# EAGLE schematic r3eflow-v2-outdated (EAGLE 9.3.0)
CREVISION: 1.0; DESIGNER: Rafael Silva

## Sheet 1 of 4: Main Controller
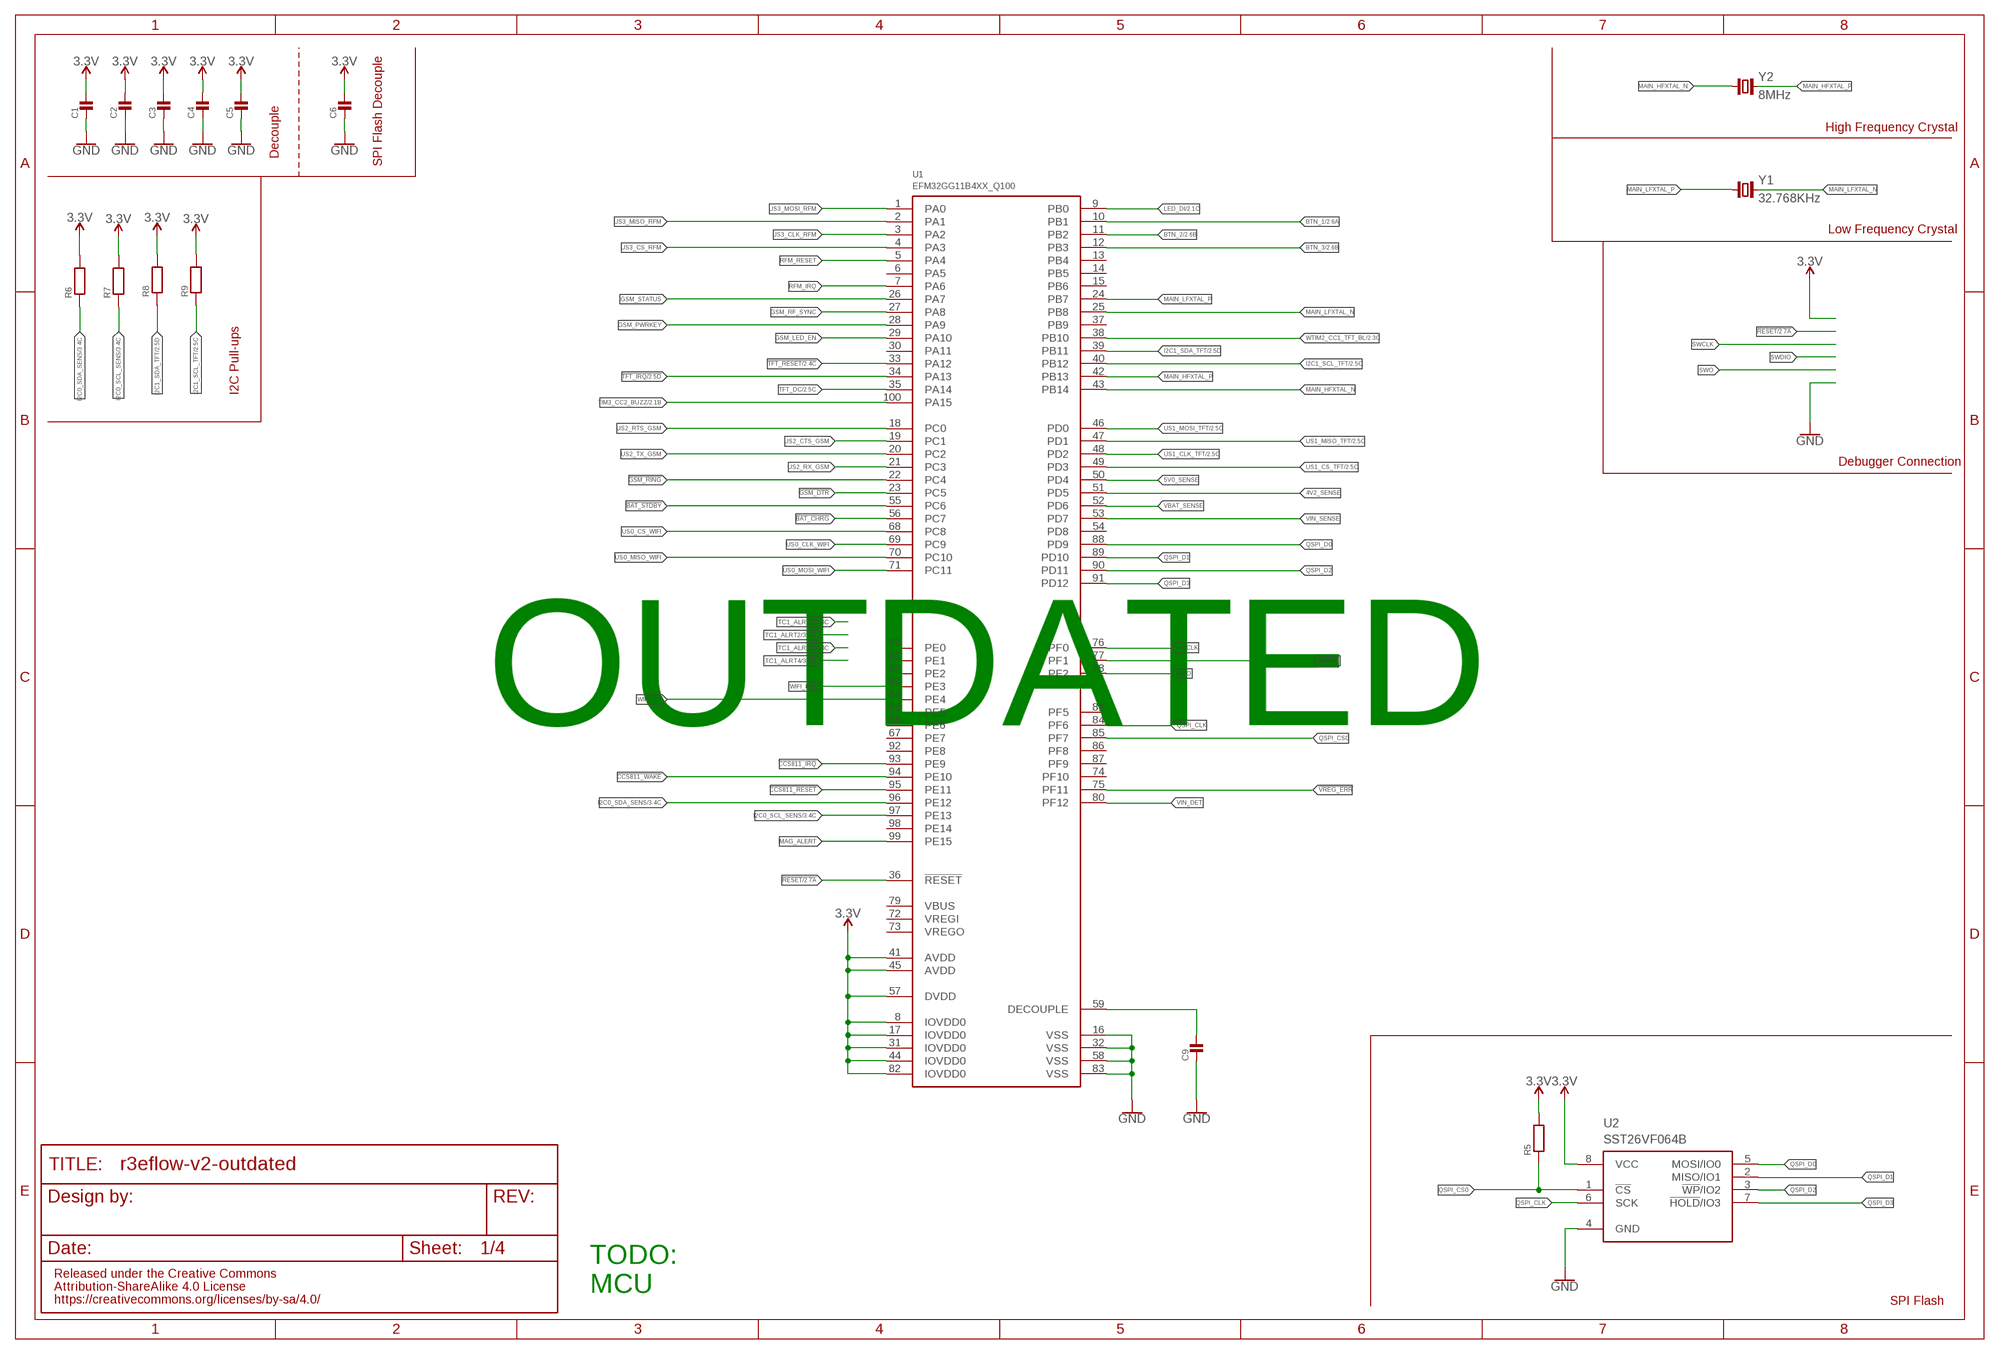
[diagram p0: schematic, sheet 1]

### Parts
C1  MLCC0603  [0603_WAVE]
C2  MLCC0603  [0603_WAVE]
C3  MLCC0603  [0603_WAVE]
C4  MLCC0603  [0603_WAVE]
C5  MLCC0603  [0603_WAVE]
C6  MLCC0603  [0603_WAVE]
C9  MLCC0603  [0603_WAVE]
R5  RESISTOR0603  [0603_WAVE]
R6  RESISTOR0603  [0603_WAVE]
R7  RESISTOR0603  [0603_WAVE]
R8  RESISTOR0603  [0603_WAVE]
R9  RESISTOR0603  [0603_WAVE]
U1  EFM32GG11B4XX_Q100  [QFP100]
U2  SST26VF064B  [WSOIC8]
Y1  32.768KHz  CRYSTALCM200S  [CM200S]
Y2  8MHz  CRYSTALNX5032GA  [2-SMD-5X3]

### Nets
3.3V: C1.P$1 C2.P$1 C3.P$1 C4.P$1 C5.P$1 C6.P$1 R5.P$2 R6.P$2 R7.P$2 R8.P$2 R9.P$2 U1.8(IOVDD0) U1.17(IOVDD0) U1.31(IOVDD0) U1.41(AVDD) U1.44(IOVDD0) U1.45(AVDD) U1.57(DVDD) U1.82(IOVDD0) U2.8(VCC) ; also sheet 2,3,4
4V2_SENSE: U1.51(PD5)
5V0_SENSE: U1.50(PD4)
!BAT_CHRG: U1.56(PC7)
!BAT_STDBY: U1.55(PC6)
!CCS811_IRQ: U1.93(PE9)
!CCS811_RESET: U1.95(PE11)
!CCS811_WAKE: U1.94(PE10)
!GSM_DTR: U1.23(PC5)
!GSM_RING: U1.22(PC4)
!RESET: U1.36(!RESET) ; also sheet 2
!TFT_IRQ: U1.34(PA13) ; also sheet 2
!TFT_RESET: U1.33(PA12) ; also sheet 2
!VREG_ERR: U1.75(PF11)
BTN_1: U1.10(PB1) ; also sheet 2
BTN_2: U1.11(PB2) ; also sheet 2
BTN_3: U1.12(PB3) ; also sheet 2
GND: C1.P$2 C2.P$2 C3.P$2 C4.P$2 C5.P$2 C6.P$2 C9.P$2 U1.16(VSS) U1.32(VSS) U1.58(VSS) U1.83(VSS) U2.4(GND) ; also sheet 2,3,4
GSM_LED_EN: U1.29(PA10)
GSM_PWRKEY: U1.28(PA9)
GSM_RF_SYNC: U1.27(PA8)
GSM_STATUS: U1.26(PA7)
I2C0_SCL_SENS: R7.P$1 U1.97(PE13) ; also sheet 3
I2C0_SDA_SENS: R6.P$1 U1.96(PE12) ; also sheet 3
I2C1_SCL_TFT: R9.P$1 U1.40(PB12) ; also sheet 2
I2C1_SDA_TFT: R8.P$1 U1.39(PB11) ; also sheet 2
LED_DI: U1.9(PB0) ; also sheet 2
MAG_ALERT: U1.99(PE15)
MAIN_HFXTAL_N: U1.43(PB14) Y2.1
MAIN_HFXTAL_P: U1.42(PB13) Y2.2
MAIN_LFXTAL_N: U1.25(PB8) Y1.4
MAIN_LFXTAL_P: U1.24(PB7) Y1.1
N$9: C9.P$1 U1.59(DECOUPLE)
QSPI_CLK: U1.84(PF6) U2.6(SCK)
QSPI_CS0: R5.P$1 U1.85(PF7) U2.1(!CS!)
QSPI_D0: U1.88(PD9) U2.5(MOSI/IO0)
QSPI_D1: U1.89(PD10) U2.2(MISO/IO1)
QSPI_D2: U1.90(PD11) U2.3(!WP!/IO2)
QSPI_D3: U1.91(PD12) U2.7(!HOLD!/IO3)
RFM_IRQ: U1.7(PA6)
RFM_RESET: U1.5(PA4)
SWCLK: U1.76(PF0)
SWDIO: U1.77(PF1)
SWO: U1.78(PF2)
TFT_DC: U1.35(PA14) ; also sheet 2
TIM3_CC2_BUZZ: U1.100(PA15) ; also sheet 2
US0_CLK_WIFI: U1.69(PC9)
US0_CS_WIFI: U1.68(PC8)
US0_MISO_WIFI: U1.70(PC10)
US0_MOSI_WIFI: U1.71(PC11)
US1_CLK_TFT: U1.48(PD2) ; also sheet 2
US1_CS_TFT: U1.49(PD3) ; also sheet 2
US1_MISO_TFT: U1.47(PD1) ; also sheet 2
US1_MOSI_TFT: U1.46(PD0) ; also sheet 2
US2_CTS_GSM: U1.19(PC1)
US2_RTS_GSM: U1.18(PC0)
US2_RX_GSM: U1.21(PC3)
US2_TX_GSM: U1.20(PC2)
US3_CLK_RFM: U1.3(PA2)
US3_CS_RFM: U1.4(PA3)
US3_MISO_RFM: U1.2(PA1)
US3_MOSI_RFM: U1.1(PA0)
VBAT_SENSE: U1.52(PD6)
VIN_DET: U1.80(PF12)
VIN_SENSE: U1.53(PD7)
WIFI_EN: U1.64(PE4)
WIFI_IRQ: U1.63(PE3)
WTIM2_CC1_TFT_BL: U1.38(PB10) ; also sheet 2
Unconnected: U1.6(PA5) U1.13(PB4) U1.14(PB5) U1.15(PB6) U1.30(PA11) U1.37(PB9) U1.54(PD8) U1.60(PE0) U1.61(PE1) U1.62(PE2) U1.65(PE5) U1.66(PE6) U1.67(PE7) U1.72(VREGI) U1.73(VREGO) U1.74(PF10) U1.79(VBUS) U1.81(PF5) U1.86(PF8) U1.87(PF9) U1.92(PE8) U1.98(PE14)

### Notes on the sheet
- High Frequency Crystal
- Decouple
- SPI Flash Decouple
- Low Frequency Crystal
- I2C Pull-ups
- Debugger Connection
- OUTDATED
- TODO:
  MCU
- SPI Flash

## Sheet 2 of 4: User Interface
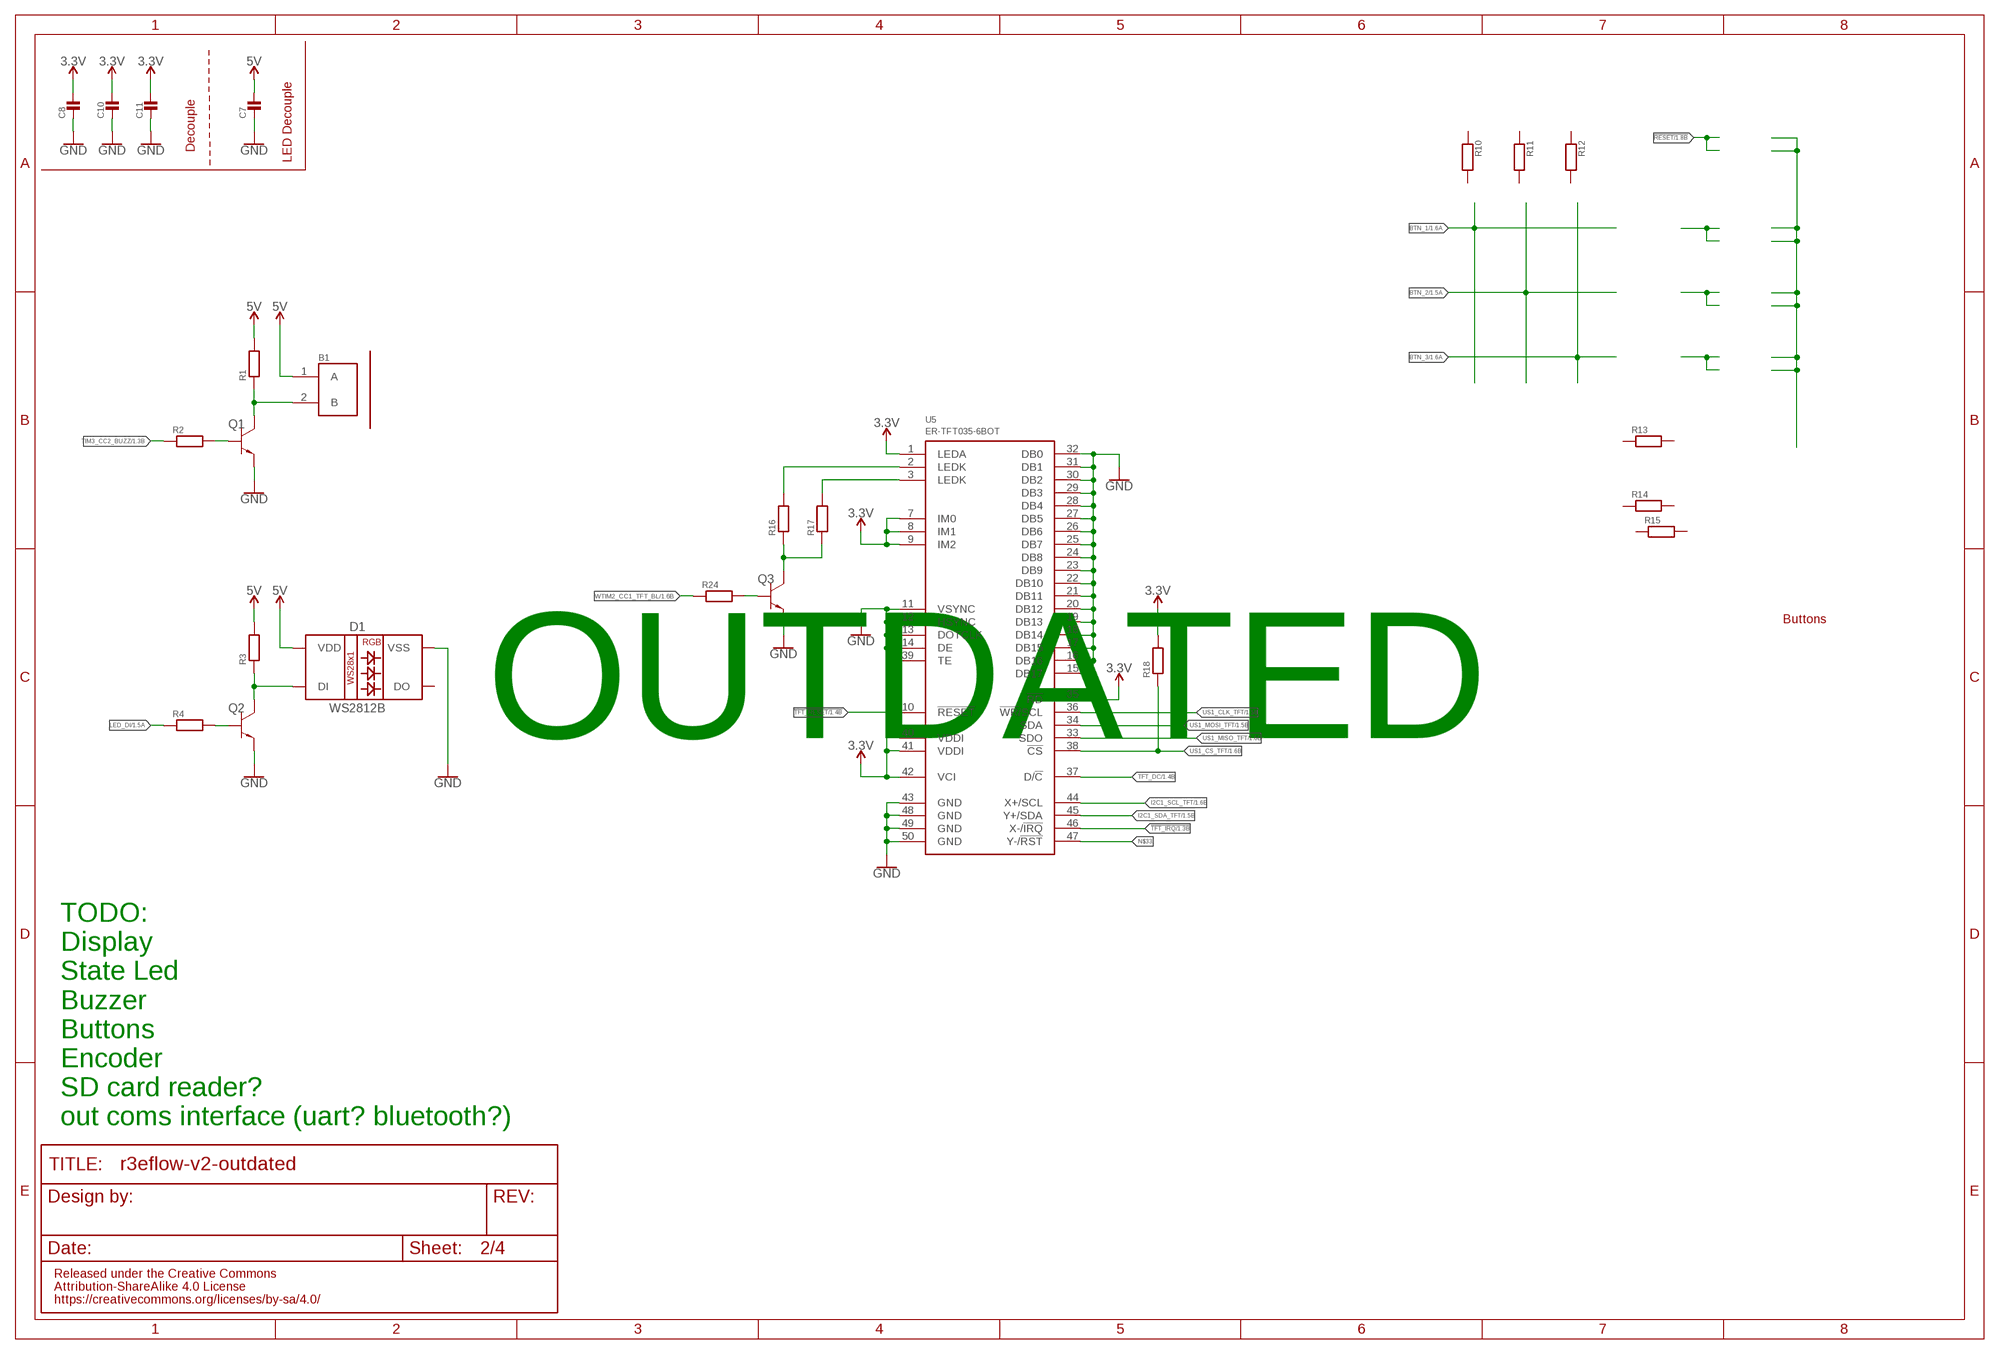
[diagram p1: schematic, sheet 2]

### Parts
B1  PKLCS1212E2400-R1  [BUZZ_PIEZO_SMD]
C7  MLCC0603  [0603_WAVE]
C8  MLCC0603  [0603_WAVE]
C10  MLCC0603  [0603_WAVE]
C11  MLCC0603  [0603_WAVE]
D1  WS2812B  [WS2812B]
Q1  BC817-40  [SOT-23-3]
Q2  BC817-40  [SOT-23-3]
Q3  BC817-40  [SOT-23-3]
R1  RESISTOR0603  [0603_WAVE]
R2  RESISTOR0603  [0603_WAVE]
R3  RESISTOR0603  [0603_WAVE]
R4  RESISTOR0603  [0603_WAVE]
R10  RESISTOR0603  [0603_WAVE]
R11  RESISTOR0603  [0603_WAVE]
R12  RESISTOR0603  [0603_WAVE]
R13  RESISTOR0603  [0603_WAVE]
R14  RESISTOR0603  [0603_WAVE]
R15  RESISTOR0603  [0603_WAVE]
R16  RESISTOR0603  [0603_WAVE]
R17  RESISTOR0603  [0603_WAVE]
R18  RESISTOR0603  [0603_WAVE]
R24  RESISTOR0603  [0603_WAVE]
U5  ER-TFT035-6BOT  [ZIF50-TFT_BACK]

### Nets
3.3V: C8.P$1 C10.P$1 C11.P$1 R18.P$2 U5.1(LEDA) U5.7(IM0) U5.8(IM1) U5.9(IM2) U5.35(!RD) U5.40(VDDI) U5.41(VDDI) U5.42(VCI) ; also sheet 1,3,4
5V: B1.1(A) C7.P$1 D1.1(VDD) R1.P$2 R3.P$2 ; also sheet 4
!TFT_IRQ: U5.46(X-/!IRQ!) ; also sheet 1
!TFT_RESET: U5.10(!RESET) ; also sheet 1
GND: C7.P$2 C8.P$2 C10.P$2 C11.P$2 D1.3(VSS) Q1.P$2(EM2) Q2.P$2(EM2) Q3.P$2(EM2) U5.11(VSYNC) U5.12(HSYNC) U5.13(DOTCLK) U5.14(DE) U5.15(DB17) U5.16(DB16) U5.17(DB15) U5.18(DB14) U5.19(DB13) U5.20(DB12) U5.21(DB11) U5.22(DB10) U5.23(DB9) U5.24(DB8) U5.25(DB7) U5.26(DB6) U5.27(DB5) U5.28(DB4) U5.29(DB3) U5.30(DB2) U5.31(DB1) U5.32(DB0) U5.39(TE) U5.43(GND) U5.48(GND) U5.49(GND) U5.50(GND) ; also sheet 1,3,4
I2C1_SCL_TFT: U5.44(X+/SCL) ; also sheet 1
I2C1_SDA_TFT: U5.45(Y+/SDA) ; also sheet 1
LED_DI: R4.P$1 ; also sheet 1
N$10: Q2.P$1(BA1) R4.P$2
N$11: D1.4(DI) Q2.P$3(C03) R3.P$1
N$17: B1.2(B) Q1.P$3(C03) R1.P$1
N$18: Q1.P$1(BA1) R2.P$2
N$22: R16.P$2 U5.2(LEDK)
N$23: R17.P$2 U5.3(LEDK)
N$24: Q3.P$3(C03) R16.P$1 R17.P$1
N$25: Q3.P$1(BA1) R24.P$2
N$33: U5.47(Y-/!RST!)
TFT_DC: U5.37(D/!C!) ; also sheet 1
TIM3_CC2_BUZZ: R2.P$1 ; also sheet 1
US1_CLK_TFT: U5.36(!WR!/SCL) ; also sheet 1
US1_CS_TFT: R18.P$1 U5.38(!CS) ; also sheet 1
US1_MISO_TFT: U5.33(SDO) ; also sheet 1
US1_MOSI_TFT: U5.34(SDA) ; also sheet 1
WTIM2_CC1_TFT_BL: R24.P$1 ; also sheet 1
Unconnected: D1.2(DO) R10.P$1 R10.P$2 R11.P$1 R11.P$2 R12.P$1 R12.P$2 R13.P$1 R13.P$2 R14.P$1 R14.P$2 R15.P$1 R15.P$2

### Notes on the sheet
- Decouple
- LED Decouple
- Buttons
- OUTDATED
- TODO:
  Display
  State Led
  Buzzer
  Buttons
  Encoder
  SD card reader?
  out coms interface (uart? bluetooth?)

## Sheet 3 of 4: Feedback and Control
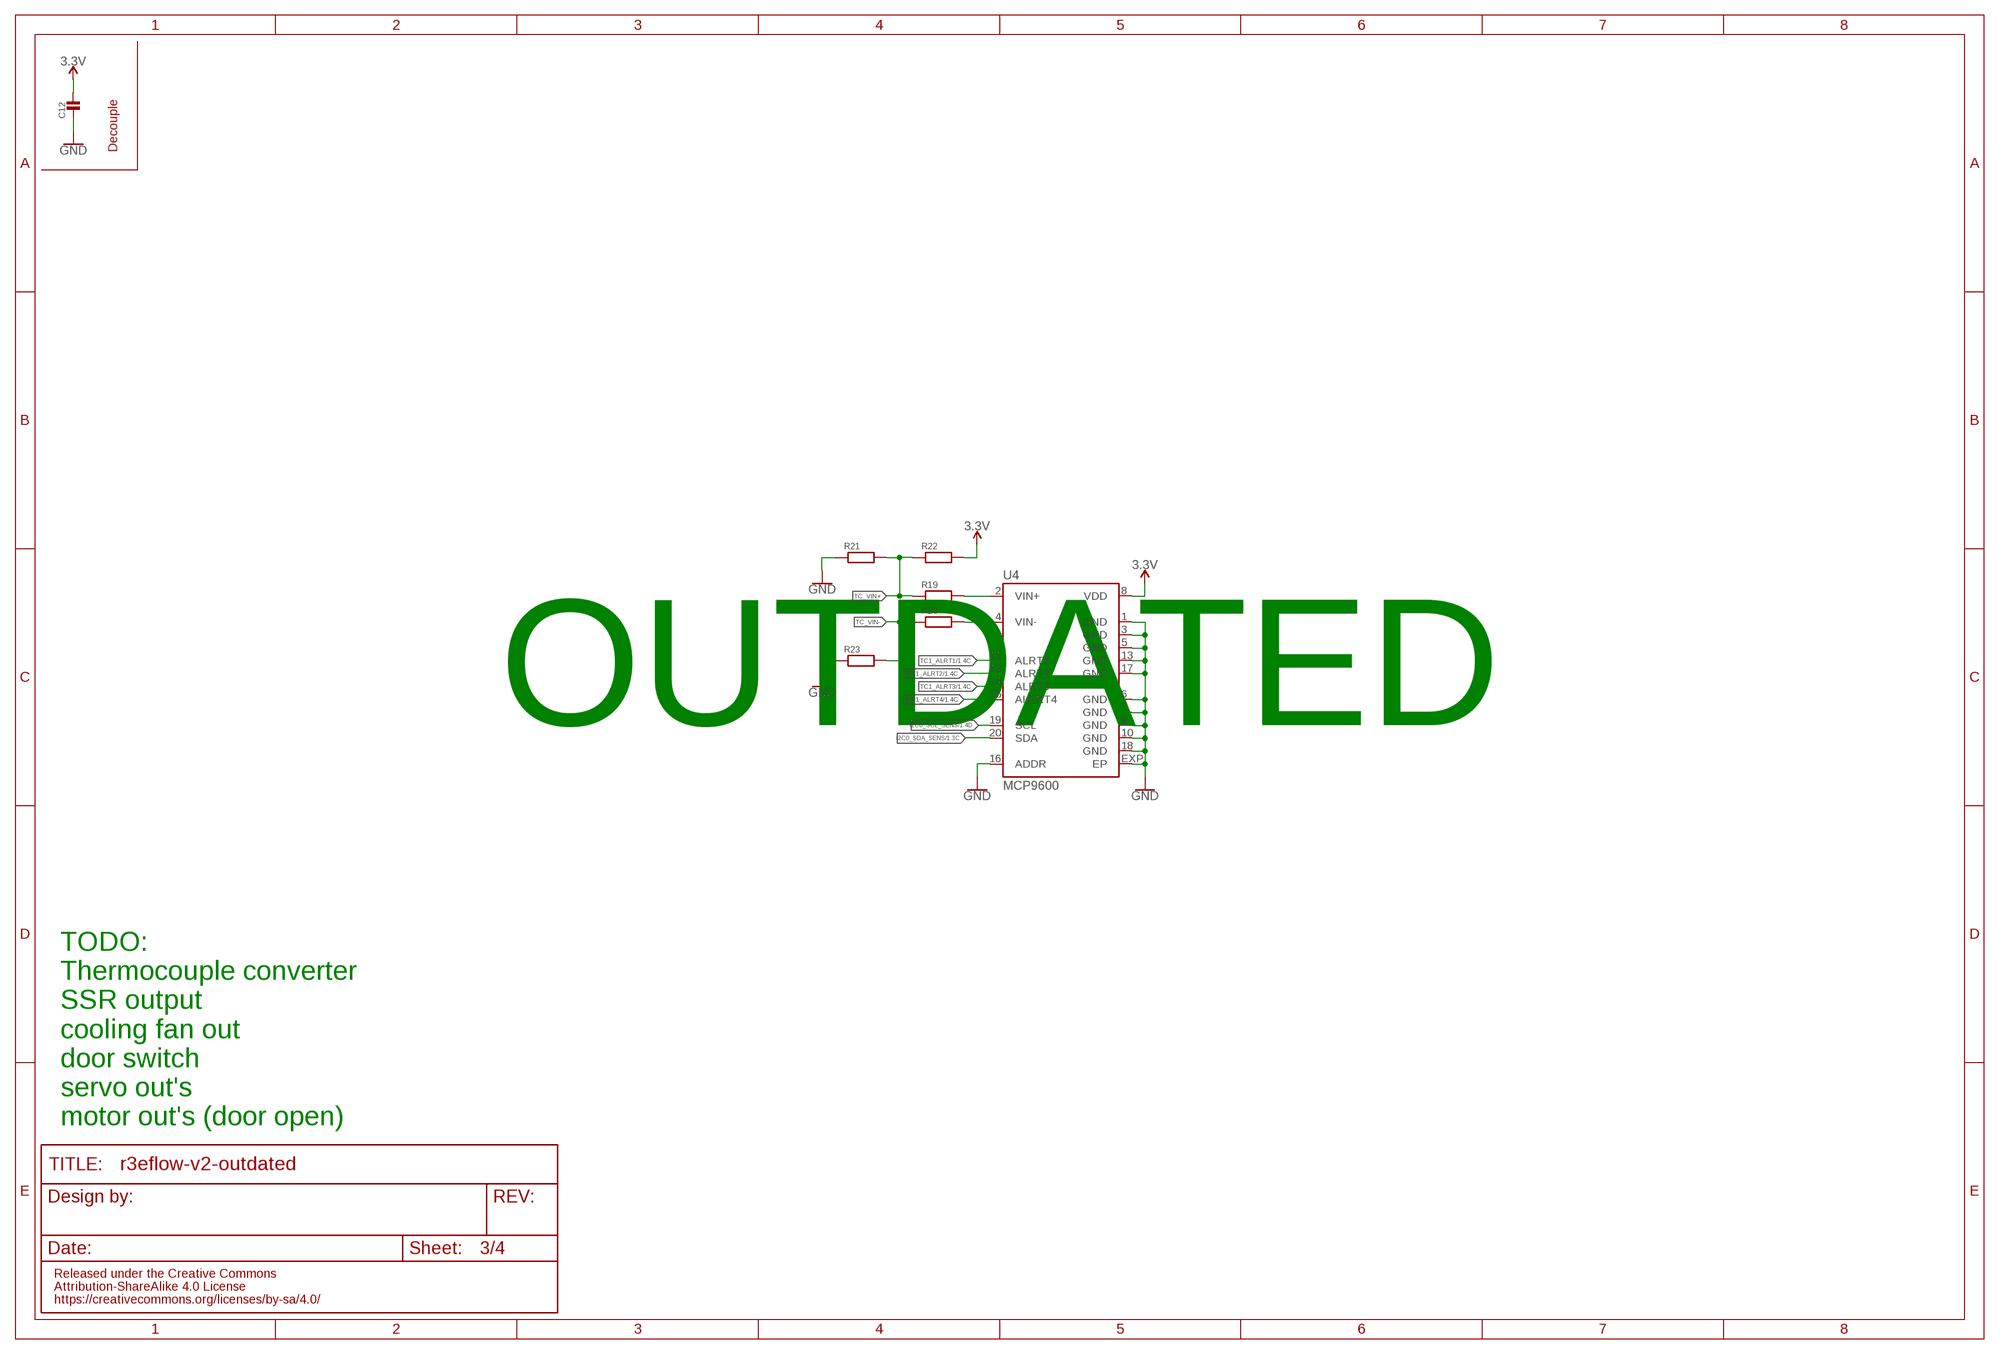
[diagram p2: schematic, sheet 3]

### Parts
C12  MLCC0603  [0603_WAVE]
R19  RESISTOR0603  [0603_WAVE]
R20  RESISTOR0603  [0603_WAVE]
R21  RESISTOR0603  [0603_WAVE]
R22  RESISTOR0603  [0603_WAVE]
R23  RESISTOR0603  [0603_WAVE]
U4  MCP9600  [TQFN20-5X5]

### Nets
3.3V: C12.P$1 R22.P$2 U4.8(VDD) ; also sheet 1,2,4
GND: C12.P$2 R21.P$1 R23.P$1 U4.1(GND) U4.3(GND) U4.5(GND) U4.6(GND) U4.7(GND) U4.9(GND) U4.10(GND) U4.13(GND) U4.16(ADDR) U4.17(GND) U4.18(GND) U4.EXP(EP) ; also sheet 1,2,4
I2C0_SCL_SENS: U4.19(SCL) ; also sheet 1
I2C0_SDA_SENS: U4.20(SDA) ; also sheet 1
N$26: R19.P$2 U4.2(VIN+)
N$27: R20.P$2 U4.4(VIN-)
TC1_ALRT1: U4.11(ALRT1) ; also sheet 1
TC1_ALRT2: U4.12(ALRT2) ; also sheet 1
TC1_ALRT3: U4.14(ALRT3) ; also sheet 1
TC1_ALRT4: U4.15(ALERT4) ; also sheet 1
TC_VIN+: R19.P$1 R21.P$2 R22.P$1
TC_VIN-: R20.P$1 R23.P$2

### Notes on the sheet
- Decouple
- OUTDATED
- TODO:
  Thermocouple converter
  SSR output
  cooling fan out
  door switch
  servo out's
  motor out's (door open)

## Sheet 4 of 4: Power
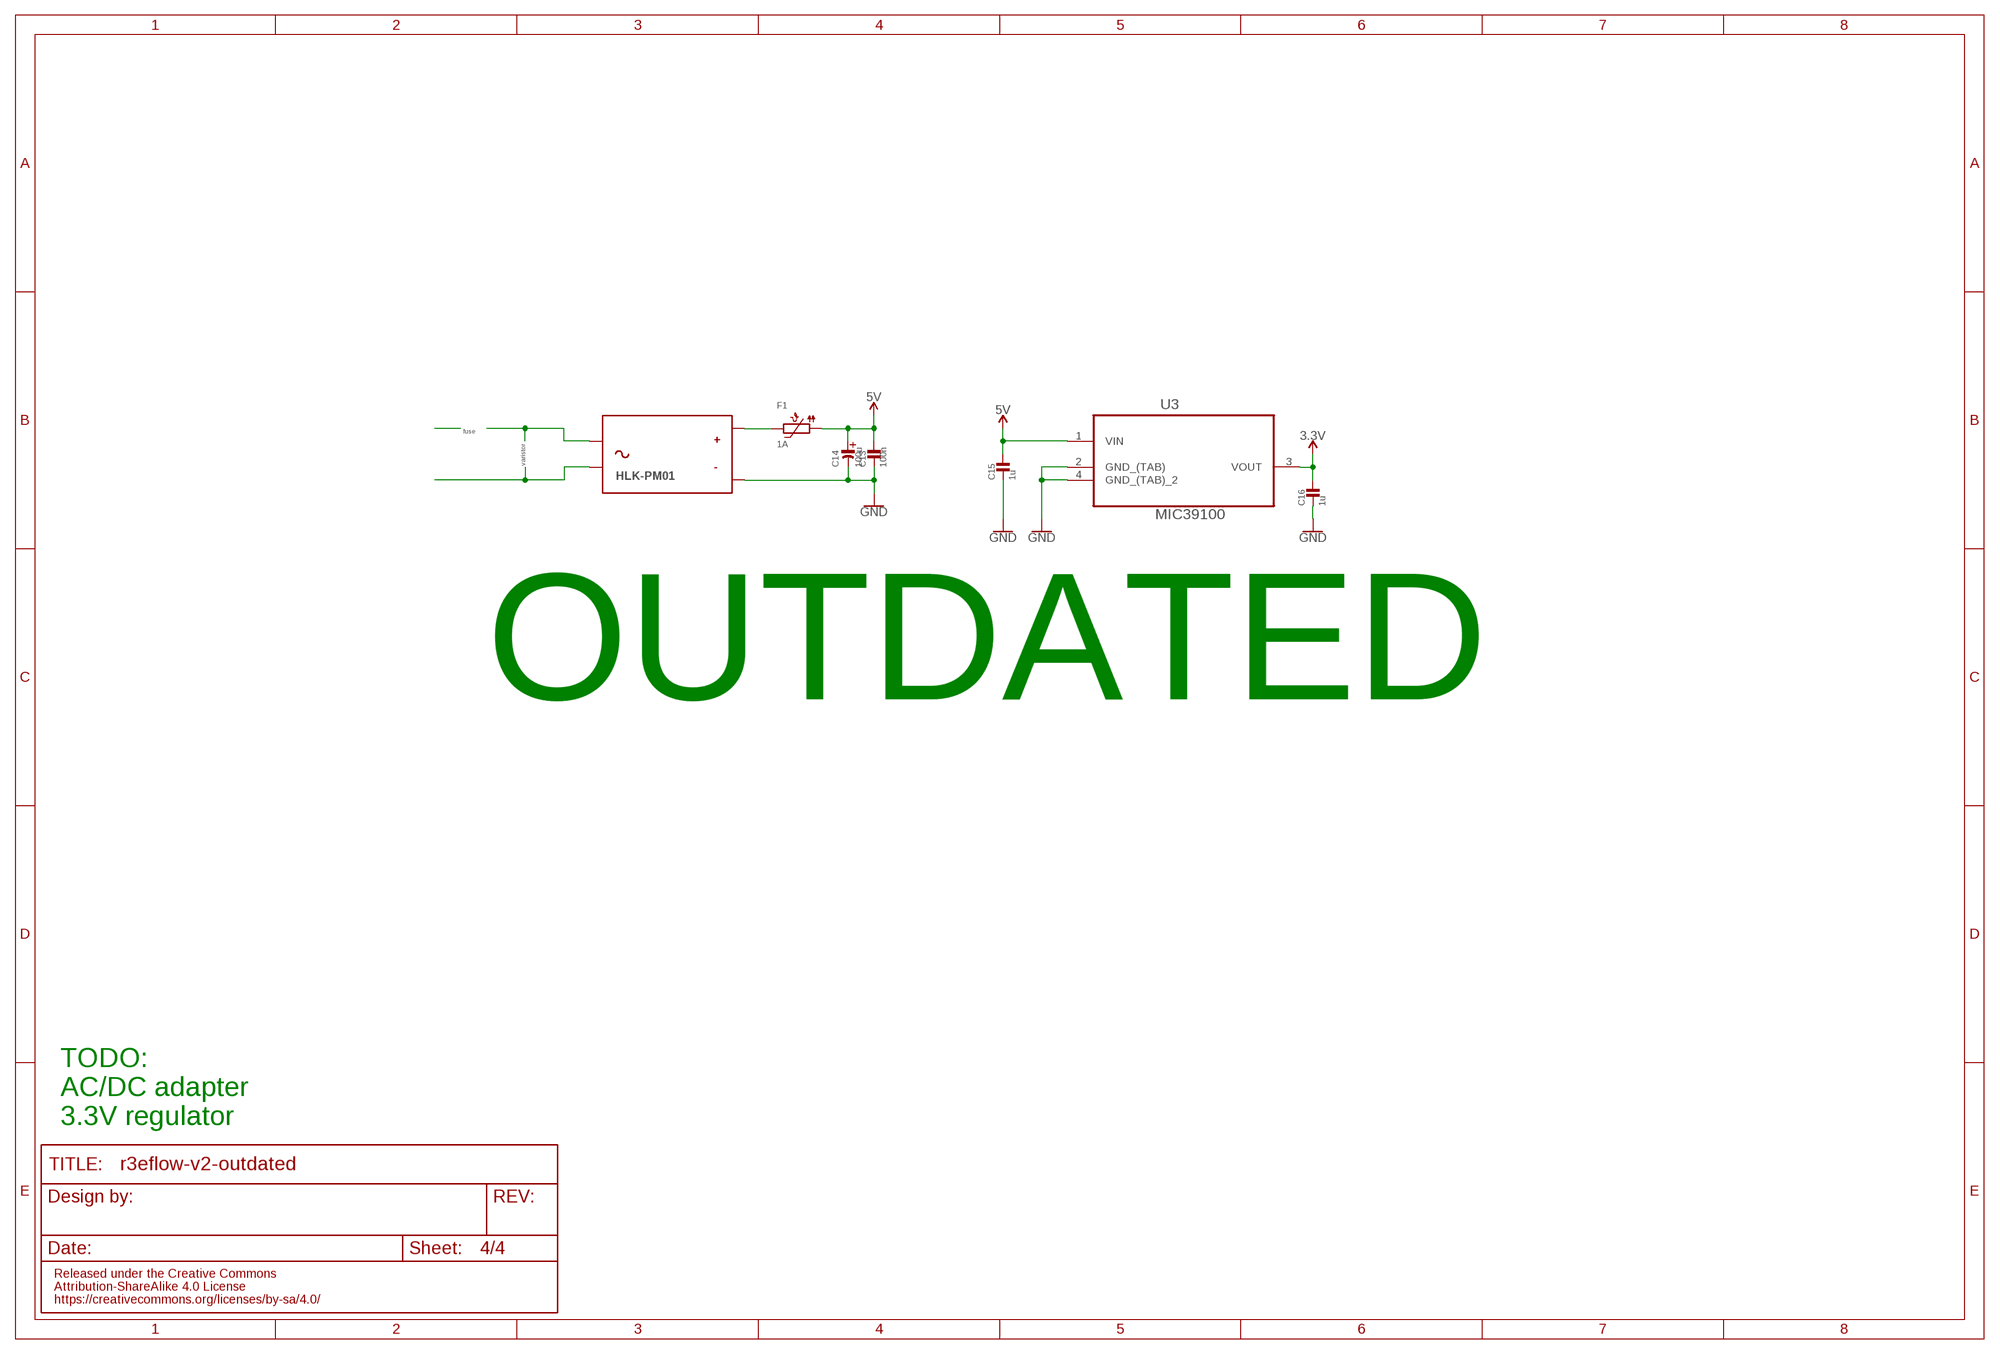
[diagram p3: schematic, sheet 4]

### Parts
C13  100n  MLCC0603  [0603_WAVE]
C14  100u  CAPACITOR_EL10X10  [10X10-EL]
C15  1u  MLCC0603  [0603_WAVE]
C16  1u  MLCC0603  [0603_WAVE]
F1  1A  PTC1812  [PTC1812]
U3  MIC39100  [SOT230P700X180-4N]
U$5  HLK-PM01  [HLK-PM01]

### Nets
3.3V: C16.P$1 U3.3(VOUT) ; also sheet 1,2,3
5V: C13.P$1 C14.AN C15.P$1 F1.P$1 U3.1(VIN) ; also sheet 2
GND: C13.P$2 C14.CAT(CA) C15.P$2 C16.P$2 U3.2(GND_(TAB)) U3.4(GND_(TAB)_2) U$5.-VO ; also sheet 1,2,3
N$28: U$5.AC1
N$29: U$5.AC2
N$31: F1.P$2 U$5.+VO

### Notes on the sheet
- fuse
- varistor
- OUTDATED
- TODO:
  AC/DC adapter
  3.3V regulator

## Library data of the parts
B1 = Eletromechanical > Buzzer:PKLCS1212E2400-R1
C1-C13 C15 C16 = Passive Components > Capacitors > Multilayer Ceramic Capacitors MLCC:MLCC: KEMET’s X7R dielectric features a 125°C maximum operating temperature and is considered temperature stable. The Electronics Components, Assemblies and Materials Association (EIA) characterizes X7R dielectric as a Class II material. Components of this classification are fixed, ceramic dielectric capacitors suited for bypass and decoupling applications or for frequency discriminating circuits where Q and stability of capacitance characteristics are not critical. X7R exhibits a predictable change in capacitance with respect to time and voltage, boasting a minimal change in capacitance with reference to ambient temperature. Capacitance change is limited to ±15% from −55°C to +125°C.
C14 = Passive Components > Capacitors > Aluminium Electrolytic Capacitors:CAPACITOR_EL
D1 = Opto-electronics > LED Emitters:WS2812B: WS2812B SMD addressable RGB LED 5x5mm SMD LED with built-in controller IC. Color: Red/Green/Blue mC Rating: RGB: 390, 660, 180 mcd Forward Voltage: RGB: 2.0, 3.0, 3.0 V Packages:WS2812B SparkFun Products: Blynk Board - ESP8266 <https://www.sparkfun.com/products/13794>; PROD_ID: DIO-12503
F1 = Circuit Protection > Resettable Fuses - PPTC:PTC
Q1-Q3 = Semiconductors > Discrete Semiconductors > Transistors > Bipolar Transistors - BJT:BC817-40
R1-R24 = Passive Components > Resistors > Chip Resistors:RESISTOR: Resistors For new designs, use the packages preceded by an '_' character since they are more reliable: The following footprints should be used on most boards: _0402 - Standard footprint for regular board layouts _0603 - Standard footprint for regular board layouts _0805 - Standard footprint for regular board layouts _1206 - Standard footprint for regular board layouts For extremely tight-pitch boards where space is at a premium, the following 'micro-pitch' footprints can be used (smaller pads, no silkscreen outline, etc.): _0402MP - Micro-pitch footprint for very dense/compact boards _0603MP - Micro-pitch footprint for very dense/compact boards _0805MP - Micro-pitch footprint for very dense/compact boards _1206MP - Micro-pitch footprint for very dense/compact boards
U1 = Semiconductors > Embedded Processors & Controllers > Microcontrollers - MCU:EFM32GG11B4XX_Q100
U2 = Semiconductors > Integrated Circuits - ICs > Memory ICs > Flash:SST26VF064B
U3 = Power > LDO Voltage Regulators:MIC39100: IC, LDO VOLT REG, 3.3V, 0.3A,; MPN: MCP1824ST-3302E/DB; OC_FARNELL: 1578379; OC_NEWARK: 05N1293; PACKAGE: SOT-223-3; SUPPLIER: Microchip
U4 = Sensors > Temperature Sensors:MCP9600
U5 = Opto-electronics > Displays:ER-TFT035-6
U$5 = Power > AC\DC Converters:HLK-PM01
Y1 Y2 = Passive Components > Frequency Control & Timing Devices > Crystals:CRYSTAL: Citizen CM200S & CM250S Series